# EAGLE design v_0_1 (EAGLE 8.0.1)
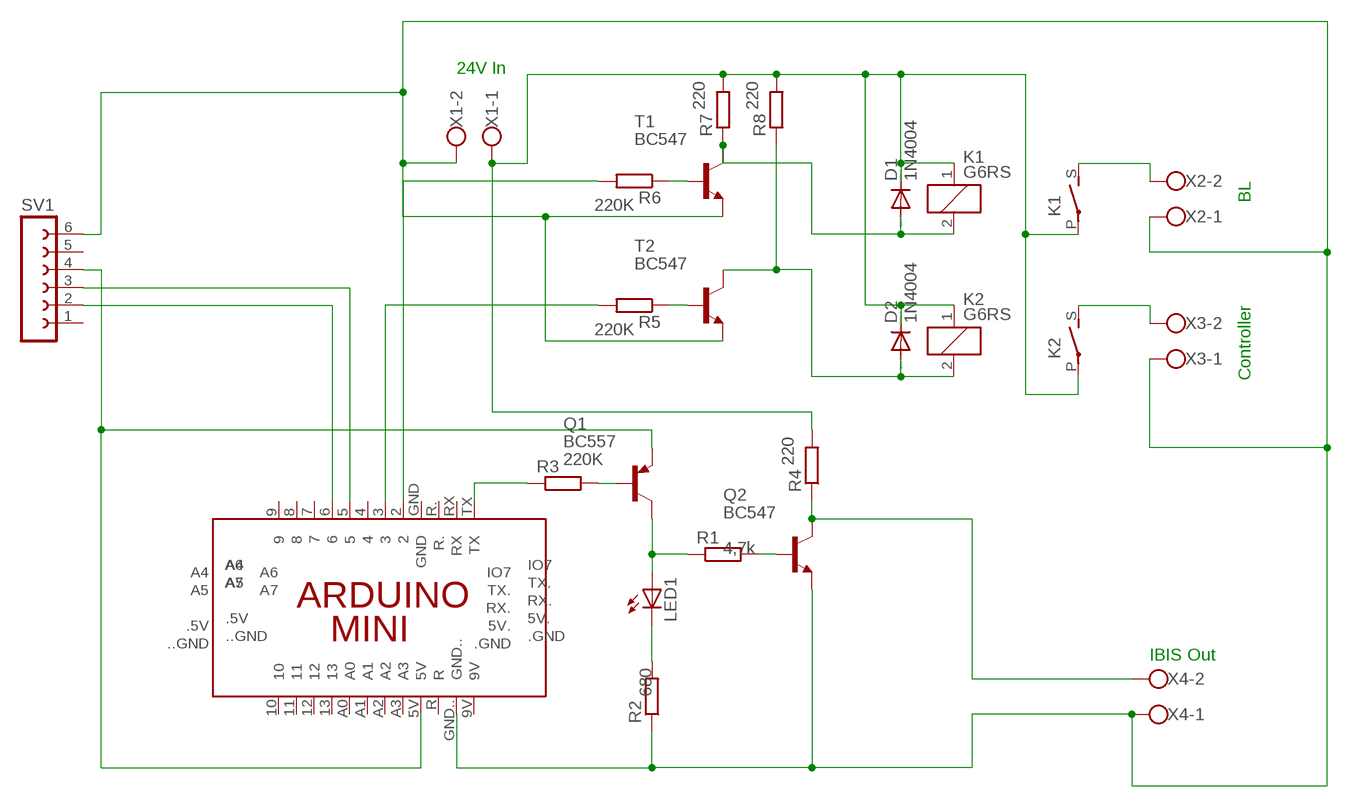
[diagram p0: schematic, sheet 1]

## Parts
D1  1N4004  [DO41-10]
D2  1N4004  [DO41-10]
K1  G6RS  [G6RS]
K2  G6RS  [G6RS]
LED1  LED5MM  [LED5MM]
PCB1  ARDUINO_MINI  [ARDUINO_MINI]
Q1  BC557  [TO92-EBC]
Q2  BC547  [TO92]
R1  R-EU_0207/10  [0207/10]
R2  R-EU_0207/10  [0207/10]
R3  R-EU_0207/10  [0207/10]
R4  R-EU_0207/10  [0207/10]
R5  R-EU_0207/10  [0207/10]
R6  R-EU_0207/10  [0207/10]
R7  R-EU_0207/10  [0207/10]
R8  R-EU_0207/10  [0207/10]
SV1  FE06-1  [FE06]
T1  BC547  [TO92]
T2  BC547  [TO92]
X1  W237-102  [W237-102]
X2  W237-102  [W237-102]
X3  W237-102  [W237-102]
X4  W237-102  [W237-102]

## Nets
N$1: PCB1.GND.. Q2.1(E) R2.1 SV1.6 T1.1(E) T2.1(E) X1.2 X2.1 X3.1 X4.1
N$2: LED1.K(C) R2.2
N$3: LED1.A Q1.C R1.1
N$4: Q1.B R3.2
N$5: PCB1.TX R3.1
N$6: PCB1.5V Q1.E SV1.4
N$7: Q2.3(C) R4.1 X4.2
N$8: Q2.2(B) R1.2
N$9: PCB1.2 R6.2
N$10: PCB1.3 R5.2
N$11: D1.A K1.2 R7.1 T1.3(C)
N$12: D1.C D2.C K1.1 K1.P(2:P) K2.1 K2.P(2:P) R4.2 R7.2 R8.2 X1.1
N$13: D2.A K2.2 R8.1 T2.3(C)
N$14: K1.S(2:S) X2.2
N$15: K2.S(2:S) X3.2
N$16: PCB1.6 SV1.2
N$17: R5.1 T2.2(B)
N$18: R6.1 T1.2(B)
N$19: PCB1.5 SV1.3
Unconnected: PCB1.4 PCB1.5V. PCB1.7 PCB1.8 PCB1.9 PCB1.9V PCB1.10 PCB1.11 PCB1.12 PCB1.13 PCB1..5V PCB1...GND PCB1..GND PCB1.A0 PCB1.A1 PCB1.A2 PCB1.A3 PCB1.A4 PCB1.A5 PCB1.A6 PCB1.A7 PCB1.GND PCB1.IO7 PCB1.R PCB1.R. PCB1.RX PCB1.RX. PCB1.TX. SV1.1 SV1.5

## Notes on the sheet
- 24V In
- BL
- Controller
- IBIS Out

## Library data of the parts
D1 D2 = diode:1N4004: DIODE general purpose rectifier, 1 A
K1 K2 = relay:G6RS: RELAY 1 x norm. open, Omron; OC_FARNELL: unknown; OC_NEWARK: unknown
LED1 = led:LED: LED OSRAM: - CHIPLED LG R971, LG N971, LY N971, LG Q971, LY Q971, LO R971, LY R971 LH N974, LH R974 LS Q976, LO Q976, LY Q976 LO Q996 - Hyper CHIPLED LW Q18S LB Q993, LB Q99A, LB R99A - SideLED LS A670, LO A670, LY A670, LG A670, LP A670 LB A673, LV A673, LT A673, LW A673 LH A674 LY A675 LS A676, LA A676, LO A676, LY A676, LW A676 LS A679, LY A679, LG A679 - Hyper Micro SIDELED® LS Y876, LA Y876, LO Y876, LY Y876 LT Y87S - SmartLED LW L88C, LW L88S LB L89C, LB L89S, LG L890 LS L89K, LO L89K, LY L89K LS L896, LA L896, LO L896, LY L896 - TOPLED LS T670, LO T670, LY T670, LG T670, LP T670 LSG T670, LSP T670, LSY T670, LOP T670, LYG T670 LG T671, LOG T671, LSG T671 LB T673, LV T673, LT T673, LW T673 LH T674 LS T676, LA T676, LO T676, LY T676, LB T676, LH T676, LSB T676, LW T676 LB T67C, LV T67C, LT T67C, LS T67K, LO T67K, LY T67K, LW E67C LS E67B, LA E67B, LO E67B, LY E67B, LB E67C, LV E67C, LT E67C LW T67C LS T679, LY T679, LG T679 LS T770, LO T770, LY T770, LG T770, LP T770 LB T773, LV T773, LT T773, LW T773 LH T774 LS E675, LA E675, LY E675, LS T675 LS T776, LA T776, LO T776, LY T776, LB T776 LHGB T686 LT T68C, LB T68C - Hyper Mini TOPLED® LB M676 - Mini TOPLED Santana® LG M470 LS M47K, LO M47K, LY M47K Source: http://www.osram.convergy.de LUXEON: - LUMILED® LXK2-PW12-R00, LXK2-PW12-S00, LXK2-PW14-U00, LXK2-PW14-V00 LXK2-PM12-R00, LXK2-PM12-S00, LXK2-PM14-U00 LXK2-PE12-Q00, LXK2-PE12-R00, LXK2-PE12-S00, LXK2-PE14-T00, LXK2-PE14-U00 LXK2-PB12-K00, LXK2-PB12-L00, LXK2-PB12-M00, LXK2-PB14-N00, LXK2-PB14-P00, LXK2-PB14-Q00 LXK2-PR12-L00, LXK2-PR12-M00, LXK2-PR14-Q00, LXK2-PR14-R00 LXK2-PD12-Q00, LXK2-PD12-R00, LXK2-PD12-S00 LXK2-PH12-R00, LXK2-PH12-S00 LXK2-PL12-P00, LXK2-PL12-Q00, LXK2-PL12-R00 Source: www.luxeon.com KINGBRIGHT: KA-3528ASYC Source: www.kingbright.com
PCB1 = E14_Arduino_revC:ARDUINO_MINI: Device for representing an Arduino Mini board with a footprint in an EAGLE design. Created by Dave Young for Element14. More EAGLE documentation at: http://www.element14.com/community/community/knode/cadsoft_eagle
Q1 = transistor-pnp:BC557*: PNP Transistror
Q2 = transistor-npn:BC547*: NPN Transistor
R1 = resistor:R-EU_: RESISTOR, European symbol; R: 4,7k
R2 = resistor:R-EU_: RESISTOR, European symbol; R: 680
R3 R5 R6 = resistor:R-EU_: RESISTOR, European symbol; R: 220K
R4 R7 R8 = resistor:R-EU_: RESISTOR, European symbol; R: 220
SV1 = con-lsta:FE06-1: FEMALE HEADER; OC_FARNELL: unknown; OC_NEWARK: unknown
T1 T2 = transistor:BC547: NPN TRANSISTOR
X1-X4 = con-wago-500:W237-102: WAGO SCREW CLAMP; MPN: 237-102; OC_FARNELL: unknown; OC_NEWARK: 70K9898

## Net classes
0 default: width 0.002 mm

## Board
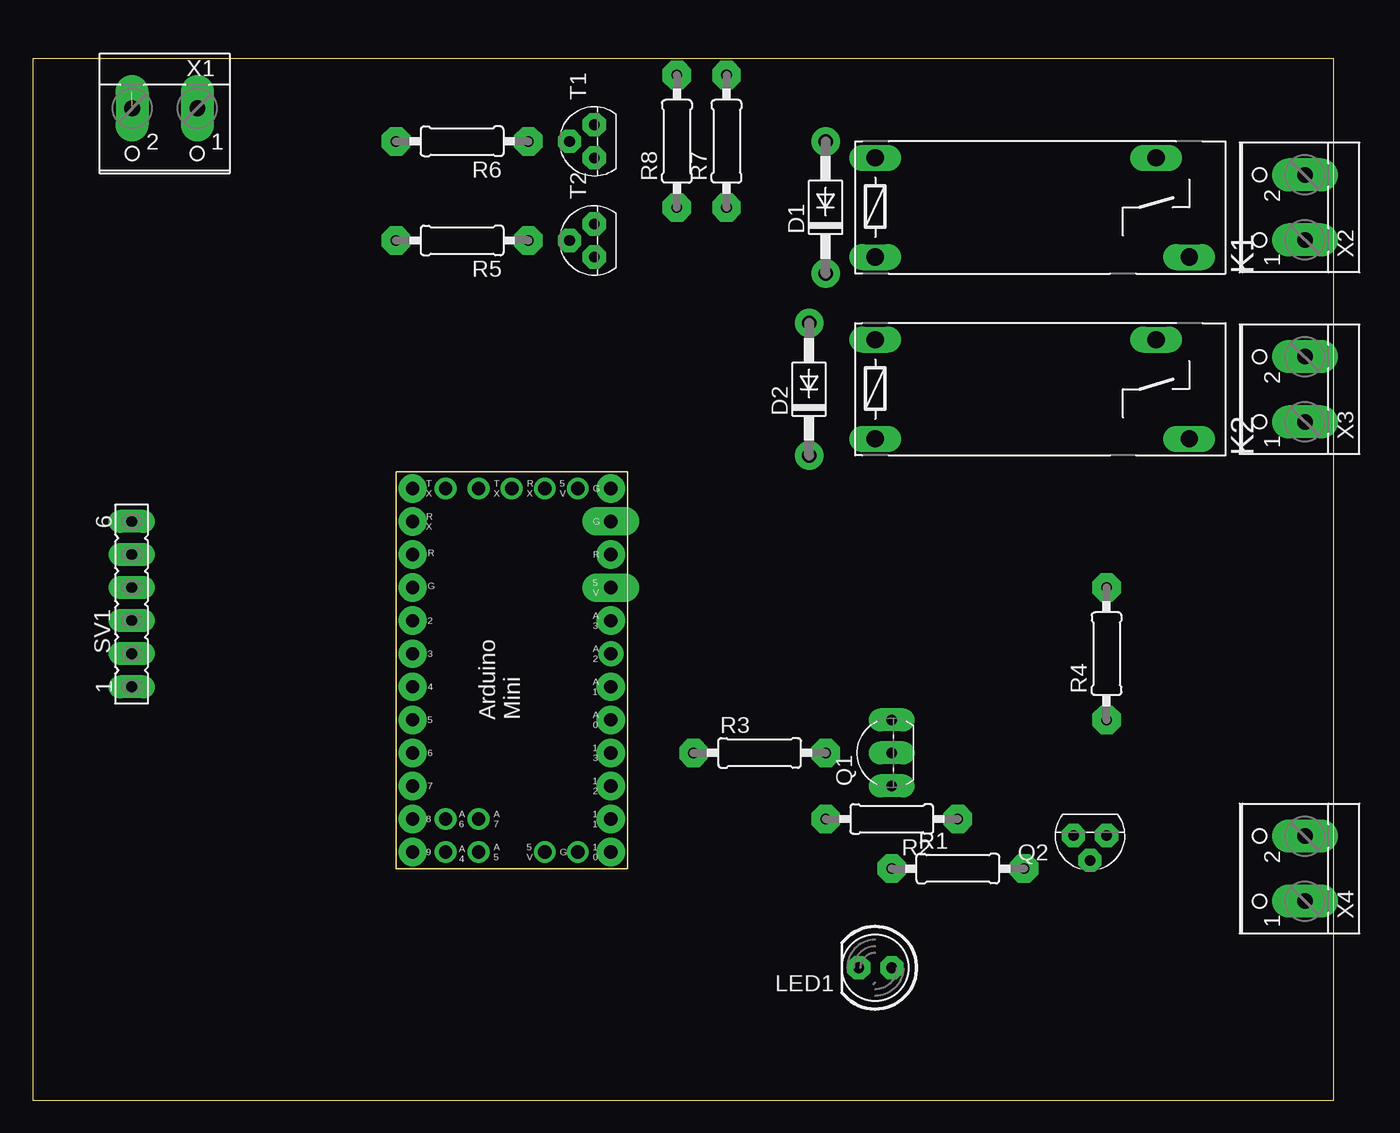
[diagram p1: board, top side]
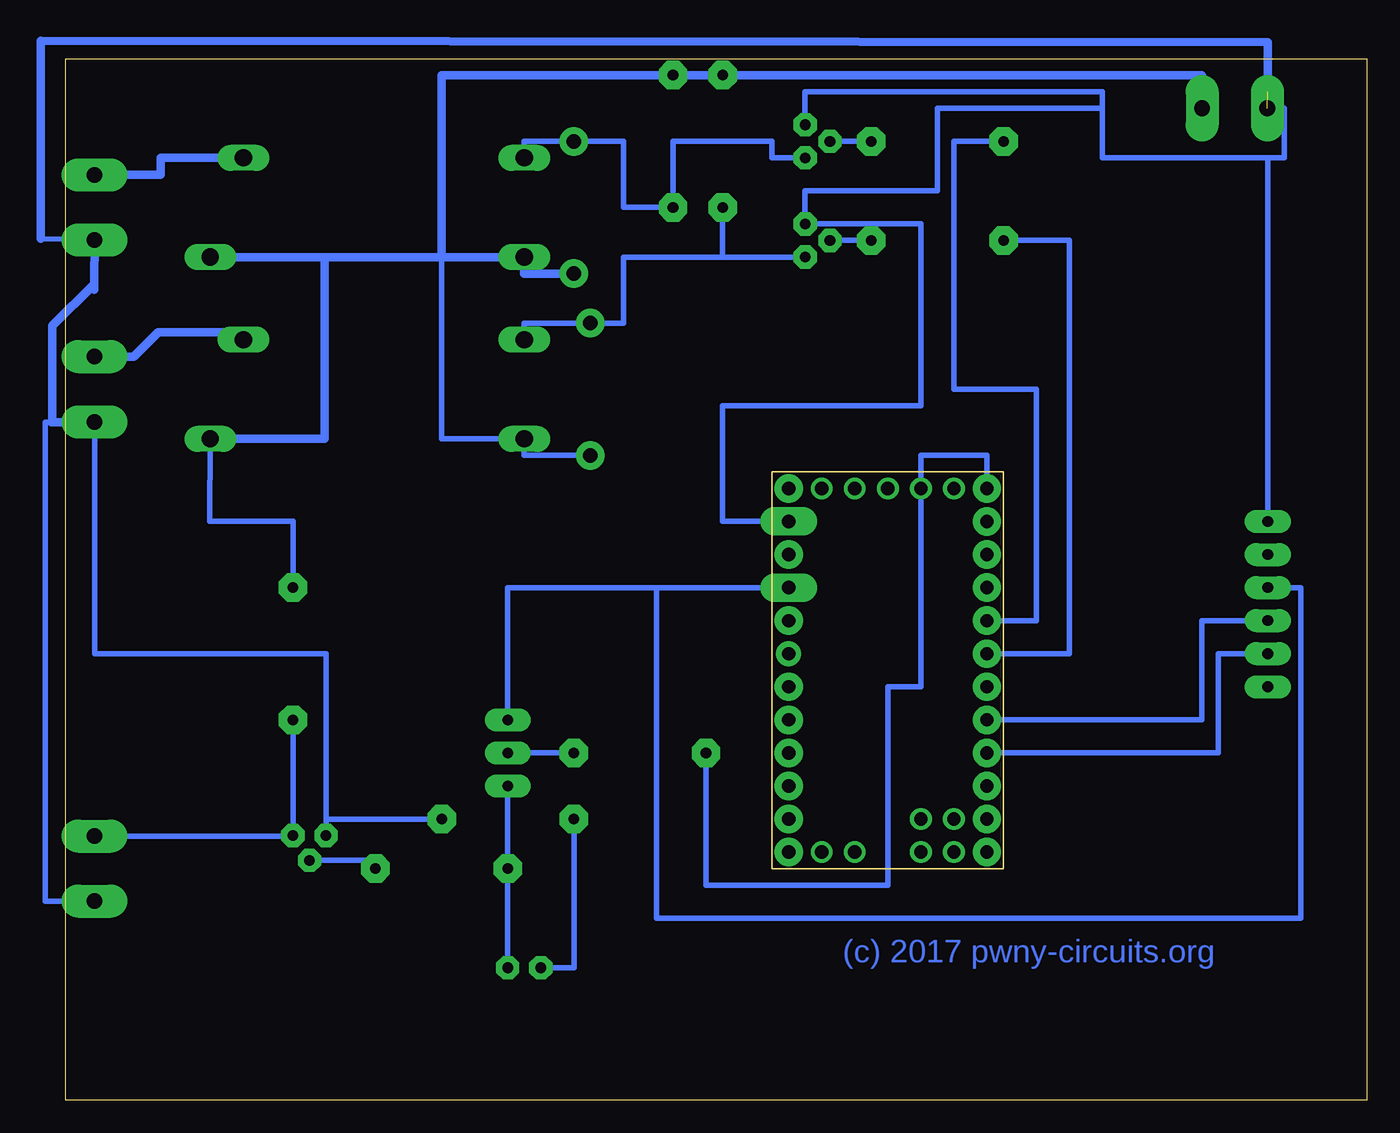
[diagram p2: board, bottom side, seen from below]

Size 100 x 80 mm. Coordinates in mm from the lower left corner, seen from the top.
Outline: 0,0 100,0 100,80 0,80 0,0
Copper layers (1*16): Top 0.07mm / dielectric 1.5mm / Bottom 0.07mm
Design rules "default *": minimum track width 12mil, minimum drill 24mil, track to track 8mil, track to pad 8mil, pad to pad 8mil, via to via 8mil, smd to smd 8mil, copper to edge 40mil, drill to drill 8mil, minimum pad ring 10mil, minimum via ring 8mil, stop-mask expansion 4mil, vias tented up to drill 0mil, thermal gap 10mil

### Footprints (pad centres in the part's own frame; a part is rotated, then mirrored left to right if it is on the bottom)
DO41-10 = drill 1.118 pad 2.184: A 5.08,0; C -5.08,0
G6RS = drill 1.321 long: 1 -12.7,-3.81; 2 -12.7,3.81; P 11.43,-3.81; S 8.89,3.81
LED5MM = drill 0.813 pad 1.778 octagon: A -1.27,0; K 1.27,0
ARDUINO_MINI = drill 1.016 pad 2.184: 2 19.05,16.51; 3 16.51,16.51; 4 13.97,16.51; 5 11.43,16.51; 6 8.89,16.51; 7 6.35,16.51; 8 3.81,16.51; 9 1.27,16.51; 9V 29.21,1.27; 10 1.27,1.27; 11 3.81,1.27; 12 6.35,1.27; 13 8.89,1.27; A0 11.43,1.27; A1 13.97,1.27; A3 19.05,1.27; GND 21.59,16.51; R 24.13,1.27; R. 24.13,16.51; RX 26.67,16.51; TX 29.21,16.51 | drill 1.016 pad 2.184 long: 5V 21.59,1.27; GND.. 26.67,1.27 | drill 1.016 pad 1.676: 5V. 29.21,6.35; .5V 1.27,6.35; ..GND 1.27,3.81; .GND 29.21,3.81; A4 1.27,13.97; A5 1.27,11.43; A6 3.81,13.97; A7 3.81,11.43; IO7 29.21,13.97; RX. 29.21,8.89; TX. 29.21,11.43 | drill 1.016 pad 1.93: A2 16.51,1.27
TO92-EBC = drill 0.813 pad 1.778 long: B 0,-1.27; C -2.54,-1.27; E 2.54,-1.27
TO92 = drill 0.813 pad 1.778 octagon: 1 1.27,0; 2 0,1.905; 3 -1.27,0
0207/10 = drill 0.813 pad 2.184 octagon: 1 -5.08,0; 2 5.08,0
FE06 = drill 0.813 pad 1.778 long: 1 -6.35,0; 2 -3.81,0; 3 -1.27,0; 4 1.27,0; 5 3.81,0; 6 6.35,0
W237-102 = drill 1.194 pad 2.54 long: 1 -2.5,-1.27; 2 2.5,-1.27

### Placement (x,y rotation side)
D1  60.96,68.58 90 top
D2  59.69,54.61 90 top
K1  77.47,68.58 0 top
K2  77.47,54.61 0 top
LED1  64.77,10.16 180 top
PCB1  45.72,17.78 90 top
Q1  64.77,26.67 90 top
Q2  81.28,20.32 180 top
R1  71.12,17.78 0 top
R2  66.04,21.59 180 top
R3  55.88,26.67 0 top
R4  82.55,34.29 90 top
R5  33.02,66.04 180 top
R6  33.02,73.66 180 top
R7  53.34,73.66 90 top
R8  49.53,73.66 90 top
SV1  7.62,38.1 90 top
T1  43.18,73.66 90 top
T2  43.18,66.04 90 top
X1  10.16,74.93 180 top
X2  96.52,68.58 90 top
X3  96.52,54.61 90 top
X4  96.52,17.78 90 top

### Tracks (layer width: path | path; a pad name or v marks a point on that pad's centre or on a via)
N$1  (1 unrouted)
  Bottom 0.406: R2.1 80.01,21.59 Q2.1 80.01,34.29 97.79,34.29 97.79,52.07 X3.1 | X1.2 6.35,76.2 6.35,72.39 7.62,72.39 | 7.62,72.39 20.32,72.39 20.32,76.2 | 20.32,76.2 20.32,77.47 43.18,77.47 T1.1 | 20.32,76.2 33.02,76.2 33.02,69.85 43.18,69.85 T2.1 34.29,67.31 34.29,53.34 49.53,53.34 49.53,44.45 PCB1.GND.. | 99.06,15.24 99.06,15.28 X4.1 101.6,15.28 101.6,52.07 101.14,52.07 101.04,52.17 | X2.1 101.93,66.18 | SV1.6 7.62,72.39 | 97.83,62.77 97.83,62.69
  Bottom 0.635: 97.84,62.24 97.83,62.77 X2.1 | 101.14,52.07 97.79,52.07 | 101.93,66.18 101.93,81.38 7.62,81.28 7.62,77.47 | 97.83,62.69 101.04,59.49 101.04,52.17
N$2
  Bottom 0.406: LED1.K 60.96,10.16 R2.2
N$3
  Bottom 0.406: Q1.C R1.1 LED1.A
N$4
  Bottom 0.406: Q1.B R3.2
N$5
  Bottom 0.406: PCB1.TX 29.21,49.53 34.29,49.53 34.29,46.99 34.29,31.75 36.83,31.75 36.83,16.51 50.8,16.51 R3.1
N$6
  Bottom 0.406: 54.61,39.37 PCB1.5V | 54.61,39.37 66.04,39.37 Q1.E | SV1.4 5.08,39.37 5.08,13.97 54.61,13.97 54.61,39.37
N$7
  Bottom 0.406: R4.1 Q2.3 82.55,20.28 X4.2
N$8
  Bottom 0.406: Q2.2 76.2,18.41 R1.2
N$9
  Bottom 0.406: R6.2 31.75,73.66 31.75,54.61 25.4,54.61 25.4,36.83 PCB1.2
N$10
  Bottom 0.406: R5.2 22.86,66.04 22.86,34.29 PCB1.3
N$11
  Bottom 0.406: K1.2 64.77,73.66 D1.A 57.15,73.66 57.15,68.58 R7.1 53.34,73.66 45.72,73.66 45.72,72.39 T1.3
N$12
  Bottom 0.406: D2.C 64.77,49.53 K2.1 71.12,50.8 71.12,64.77 | X1.1 12.7,76.2 | K2.P 88.95,44.45 82.55,44.45 R4.2
  Bottom 0.635: D1.C 64.77,63.5 K1.1 71.12,64.77 | 80.11,64.77 71.12,64.77 | 80.11,64.77 K1.P | 12.7,76.2 12.7,78.74 R8.2 R7.2 71.12,78.74 71.12,64.77 | K2.P 80.11,50.8 80.11,64.77
N$13
  Bottom 0.406: K2.2 64.77,59.69 D2.A 57.15,59.69 57.15,64.77 49.53,64.77 | 49.53,64.77 R8.1 | T2.3 49.53,64.77
N$14
  Bottom 0.635: X2.2 92.71,71.08 92.71,72.39 K1.S
N$15
  Bottom 0.406: 85.9,59 85.73,58.83 85.95,58.83 K2.S
  Bottom 0.635: X3.2 94.81,57.11 92.91,59 85.9,59
N$16
  Bottom 0.406: SV1.2 11.43,34.29 11.43,26.67 PCB1.6
N$17
  Bottom 0.406: T2.2 R5.1
N$18
  Bottom 0.406: T1.2 R6.1
N$19
  Bottom 0.406: SV1.3 12.7,36.83 12.7,29.21 PCB1.5

### Text on the board
Bottom: (c) 2017 pwny-circuits.org